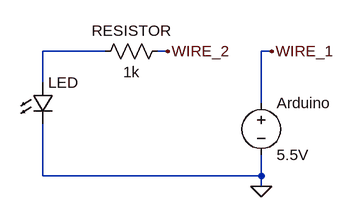
[diagram p0: schematic task_1.asc]
task_1.asc, the LTspice schematic file:
Version 4.1
SHEET 1 880 680
WIRE 144 144 48 144
WIRE 240 144 224 144
WIRE 400 144 384 144
WIRE 48 192 48 144
WIRE 384 224 384 144
WIRE 48 336 48 256
WIRE 384 336 384 304
WIRE 384 336 48 336
WIRE 384 352 384 336
FLAG 384 352 0
FLAG 400 144 WIRE_1
FLAG 240 144 WIRE_2
SYMBOL voltage 384 208 R0
SYMATTR InstName Arduino
SYMATTR Value 5.5V
SYMBOL res 240 128 R90
WINDOW 0 0 56 VBottom 2
WINDOW 3 32 56 VTop 2
SYMATTR InstName RESISTOR
SYMATTR Value 1k
SYMBOL LED 32 192 R0
SYMATTR InstName LED
SYMATTR Value ""

The netlist it stands for:
* task_1.asc
V§Arduino WIRE_1 0 5.5V
RESISTOR WIRE_2 N001 1k
D§LED N001 0
.model D D
.lib standard.dio
.backanno
.end